# EAGLE schematic PulsePalSMT_Rev_0_5 (EAGLE 6.3)
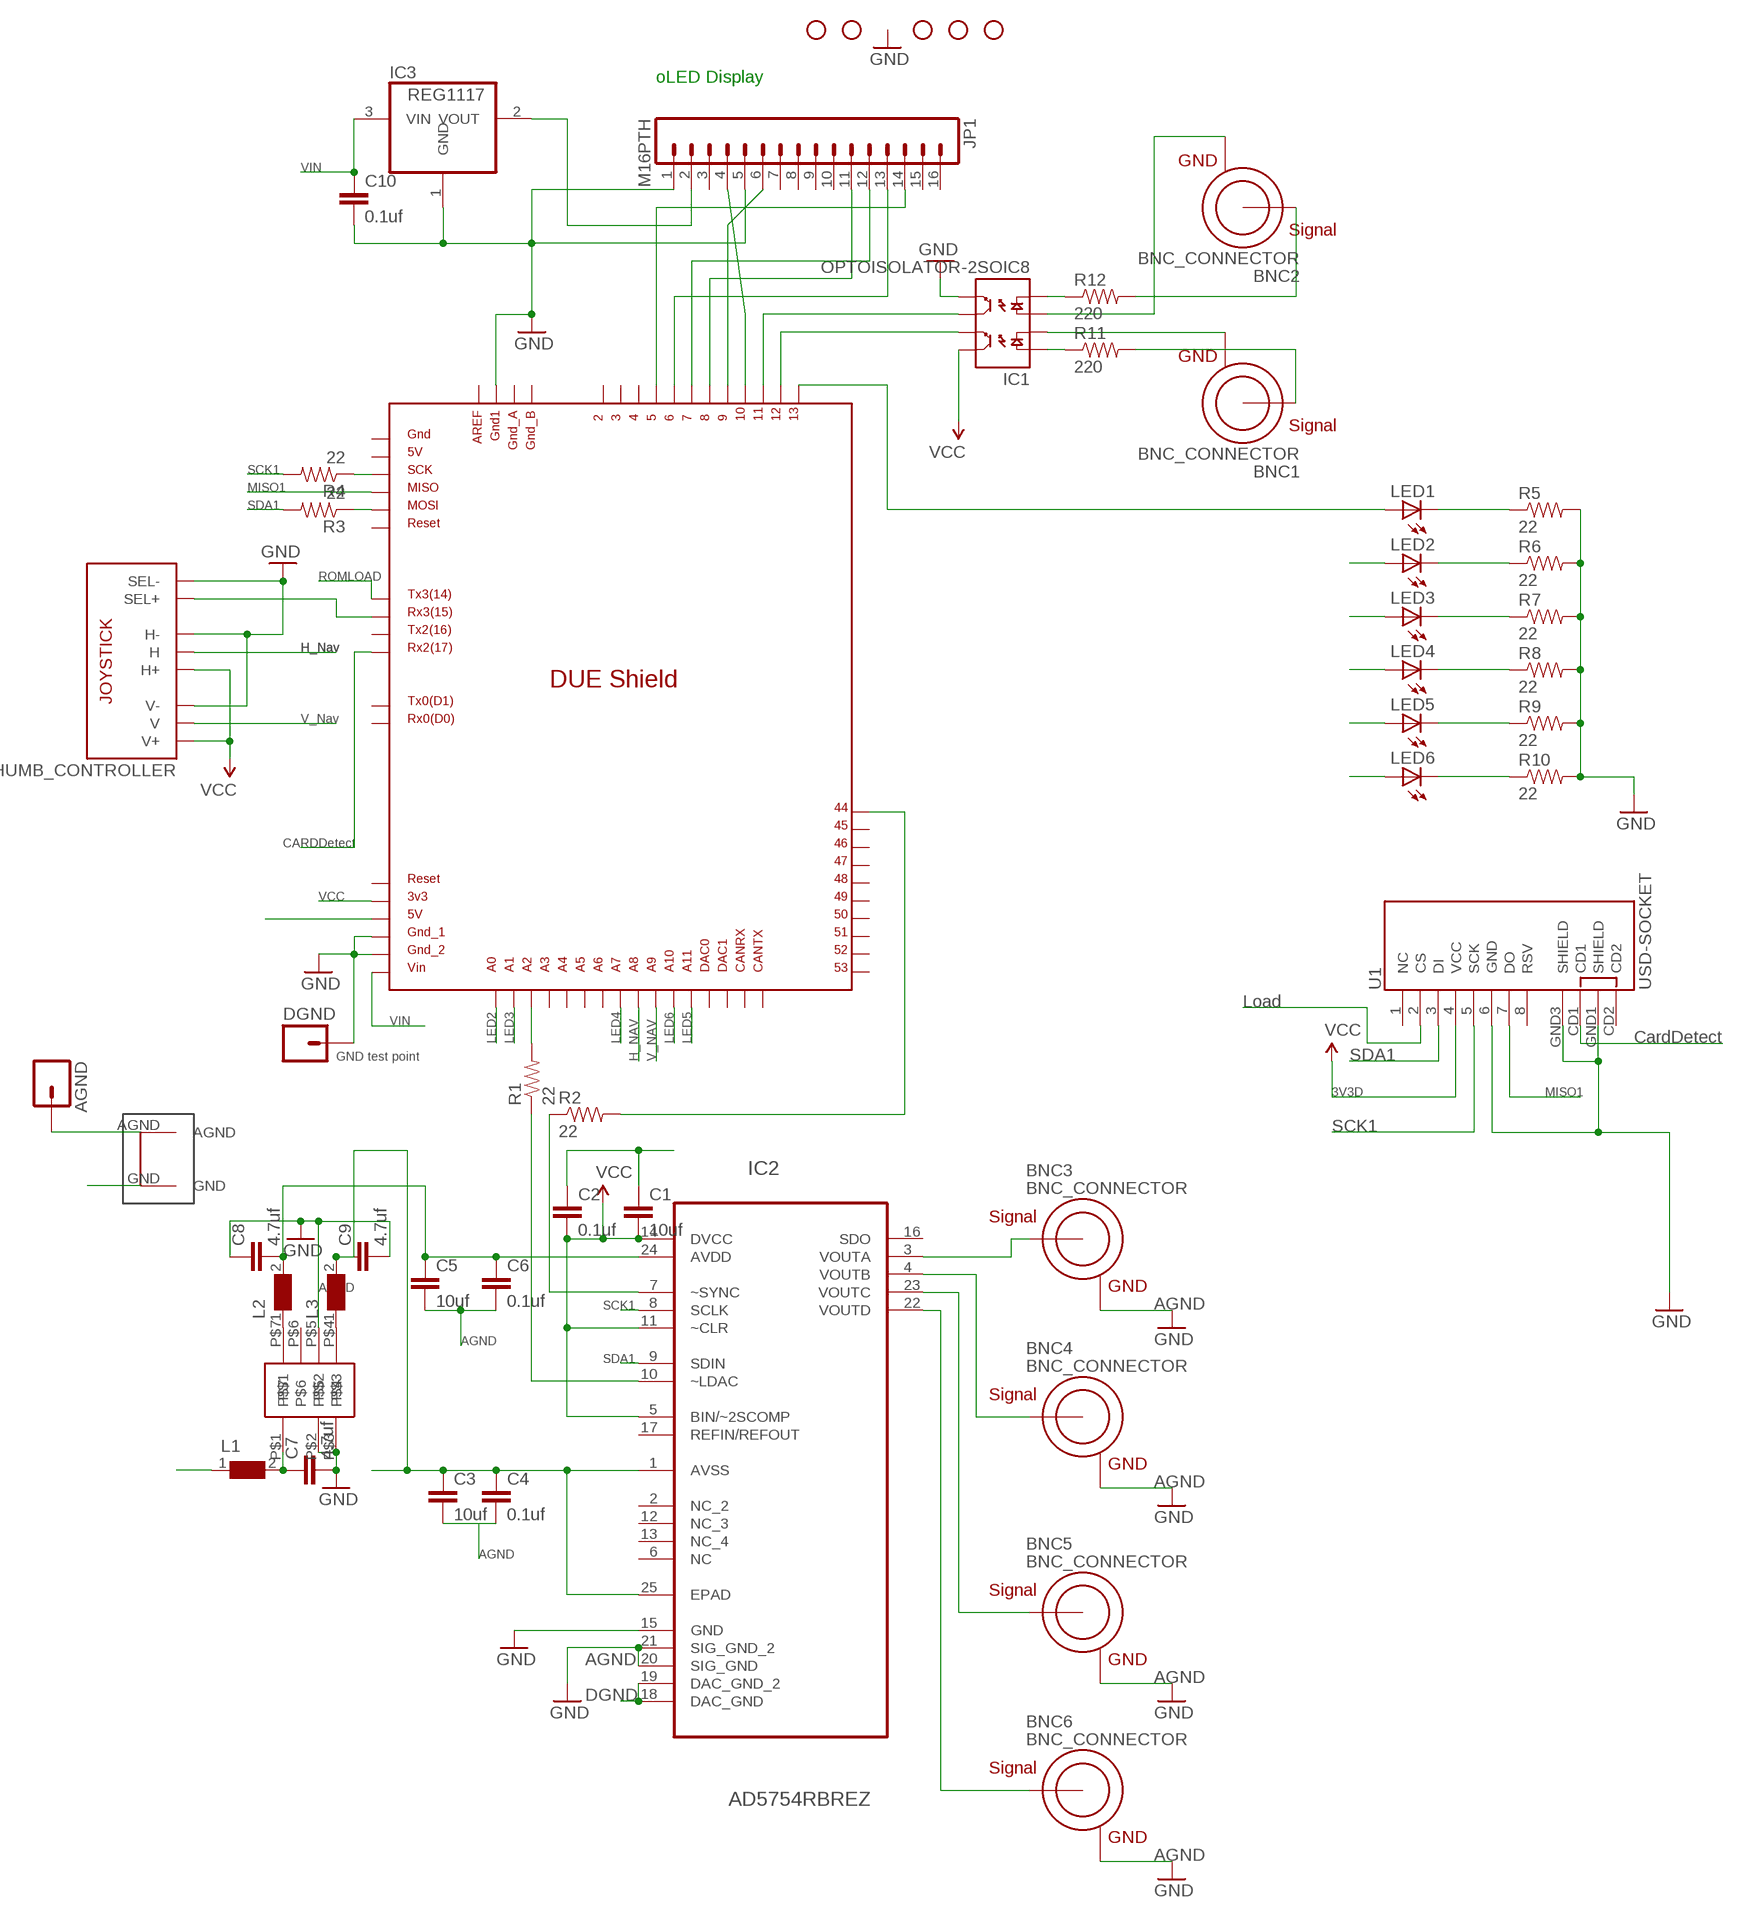
[diagram p0: schematic, sheet 1]

## Parts
AGND  M01PTH  [1X01]
ARDUINO  DUE(NORMAL)  [DUE(NORMAL)]
BNC1  BNC_CONNECTOR  [BNC_CONNECTOR]
BNC2  BNC_CONNECTOR  [BNC_CONNECTOR]
BNC3  BNC_CONNECTOR  [BNC_CONNECTOR]
BNC4  BNC_CONNECTOR  [BNC_CONNECTOR]
BNC5  BNC_CONNECTOR  [BNC_CONNECTOR]
BNC6  BNC_CONNECTOR  [BNC_CONNECTOR]
C1  10uf  CAP1206  [1206]
C2  0.1uf  CAP0603-CAP  [0603-CAP]
C3  10uf  CAP1206  [1206]
C4  0.1uf  CAP0603-CAP  [0603-CAP]
C5  10uf  CAP1206  [1206]
C6  0.1uf  CAP0603-CAP  [0603-CAP]
C7  4.7uf  CAP1206  [1206]
C8  4.7uf  CAP1206  [1206]
C9  4.7uf  CAP1206  [1206]
C10  0.1uf  CAP0603-CAP  [0603-CAP]
DGND  M01PTH  [1X01]
IC1  OPTOISOLATOR-2SOIC8  [SO08-2]
IC2  AD5754RBREZ  [SOP65P640X120-25N]
IC3  REG1117  [SOT223]
JP1  M16PTH  [1X16]
JP2  STAND-OFF  [STAND-OFF]
JP5  STAND-OFF  [STAND-OFF]
JP6  STAND-OFF  [STAND-OFF]
JP8  STAND-OFF  [STAND-OFF]
JP9  STAND-OFF  [STAND-OFF]
L1  WE-CBF-742792118_1206  [1206]
L2  WE-CBF-742792118_1206  [1206]
L3  WE-CBF-742792118_1206  [1206]
LED1  LEDCHIPLED_1206  [CHIPLED_1206]
LED2  LEDCHIPLED_1206  [CHIPLED_1206]
LED3  LEDCHIPLED_1206  [CHIPLED_1206]
LED4  LEDCHIPLED_1206  [CHIPLED_1206]
LED5  LEDCHIPLED_1206  [CHIPLED_1206]
LED6  LEDCHIPLED_1206  [CHIPLED_1206]
R1  22  RESISTOR1206  [1206]
R2  22  RESISTOR1206  [1206]
R3  22  RESISTOR1206  [1206]
R4  22  RESISTOR1206  [1206]
R5  22  RESISTOR1206  [1206]
R6  22  RESISTOR1206  [1206]
R7  22  RESISTOR1206  [1206]
R8  22  RESISTOR1206  [1206]
R9  22  RESISTOR1206  [1206]
R10  22  RESISTOR1206  [1206]
R11  220  RESISTOR1206  [1206]
R12  220  RESISTOR1206  [1206]
THUMB_CONTROLLER  JOYSTICKPTH  [JOYSTICK]
U1  USD-SOCKET  [MICROSD_1:1]
U2  TDK_LAMBDA_5_TO_BI_12_125MA  [TDK_LAMBDA_5_TO_BI_12_125MA]
U$6  GNDPLANESHRT  [GNDPLANESHRT]

## Nets
5V: ARDUINO.5V C1.2 C2.2 IC2.5(BIN/~2SCOMP) IC2.11(~CLR) IC2.14(DVCC) L1.1 ; supply symbol labelled VCC
AGND: AGND.1 BNC3.GND BNC4.GND BNC5.GND BNC6.GND C3.2 C4.2 C5.2 C6.2 IC2.15(GND) IC2.18(DAC_GND) IC2.19(DAC_GND_2) IC2.20(SIG_GND) IC2.21(SIG_GND_2) U$6.AGND ; supply symbol labelled GND
CARDDETECT: ARDUINO.RX2 U1.CD1
GND: ARDUINO.GND1 ARDUINO.GND_1 ARDUINO.GND_2 C1.1 C2.1 C7.2 C8.1 C9.2 C10.2 DGND.1 IC1.5(EM2) IC3.1(GND) JP1.1 JP1.5 R5.2 R6.2 R7.2 R8.2 R9.2 R10.2 THUMB_CONTROLLER.B2A(SEL-) THUMB_CONTROLLER.H3(H-) THUMB_CONTROLLER.V3(V-) U1.6(GND) U1.GND1(SHIELD) U1.GND3(SHIELD) U2.P$2 U2.P$3 U2.P$5 U$6.GND
H_NAV: ARDUINO.A8 THUMB_CONTROLLER.H2(H)
LED2: ARDUINO.A0 LED2.A
LED3: ARDUINO.A1 LED3.A
LED4: ARDUINO.A7 LED4.A
LED5: ARDUINO.A11 LED5.A
LED6: ARDUINO.A10 LED6.A
MISO1: ARDUINO.MISO_ICSP U1.7(DO)
N$1: L2.1 U2.P$7
N$2: L3.1 U2.P$4
N$3: BNC3.SIGNAL IC2.3(VOUTA)
N$4: BNC4.SIGNAL IC2.4(VOUTB)
N$5: BNC5.SIGNAL IC2.23(VOUTC)
N$6: BNC6.SIGNAL IC2.22(VOUTD)
N$7: BNC1.GND IC1.2(C1)
N$8: BNC1.SIGNAL R11.2
N$9: BNC2.GND IC1.3(A2)
N$10: BNC2.SIGNAL R12.2
N$11: ARDUINO.SCK_ICSP R4.1
N$12: ARDUINO.MOSI_ICSP R3.1
N$13: ARDUINO.44 R2.2
N$14: ARDUINO.A2 R1.2
N$15: IC2.7(~SYNC) R2.1
N$16: IC2.10(~LDAC) R1.1
N$17: ARDUINO.RX3 THUMB_CONTROLLER.B1A(SEL+)
N$18: ARDUINO.11 IC1.6(CL2)
N$20: IC3.2(VOUT) JP1.2
N$21: LED1.C R5.1
N$22: LED2.C R6.1
N$23: LED3.C R7.1
N$24: LED4.C R8.1
N$25: LED5.C R9.1
N$26: LED6.C R10.1
N$27: IC1.1(A1) R11.1
N$28: IC1.4(C2) R12.1
N$29: ARDUINO.12 IC1.7(EM1)
N$30: ARDUINO.5 JP1.14
N$31: ARDUINO.13 LED1.A
N$32: ARDUINO.10 JP1.4
N$33: ARDUINO.9 JP1.6
N$34: ARDUINO.8 JP1.11
N$35: ARDUINO.7 JP1.12
N$36: ARDUINO.6 JP1.13
N$39: C5.1 C6.1 C8.2 IC2.24(AVDD) L2.2
N$40: C3.1 C4.1 C9.1 IC2.1(AVSS) IC2.25(EPAD) L3.2
N$41: C7.1 L1.2 U2.P$1
ROMLOAD: ARDUINO.TX3 U1.2(CS)
SCK1: IC2.8(SCLK) R4.2 U1.5(SCK)
SDA1: IC2.9(SDIN) R3.2 U1.3(DI)
V_NAV: ARDUINO.A9 THUMB_CONTROLLER.V2(V)
VCC: ARDUINO.3V3 IC1.8(CL1) THUMB_CONTROLLER.H1(H+) THUMB_CONTROLLER.V1(V+) U1.4(VCC)
VIN: ARDUINO.VIN C10.1 IC3.3(VIN)
Unconnected: ARDUINO.2 ARDUINO.3 ARDUINO.4 ARDUINO.5V_ICSP ARDUINO.45 ARDUINO.46 ARDUINO.47 ARDUINO.48 ARDUINO.49 ARDUINO.50 ARDUINO.51 ARDUINO.52 ARDUINO.53 ARDUINO.A3 ARDUINO.A4 ARDUINO.A5 ARDUINO.A6 ARDUINO.AREF ARDUINO.CANRX ARDUINO.CANTX ARDUINO.DAC0 ARDUINO.DAC1 ARDUINO.GND_A ARDUINO.GND_B ARDUINO.GND_ICSP ARDUINO.RESET ARDUINO.RESET_ICSP ARDUINO.RX0 ARDUINO.TX0 ARDUINO.TX2 IC2.2(NC_2) IC2.6(NC) IC2.12(NC_3) IC2.13(NC_4) IC2.16(SDO) IC2.17(REFIN/REFOUT) JP1.3 JP1.7 JP1.8 JP1.9 JP1.10 JP1.15 JP1.16 U1.1(NC) U1.8(RSV) U1.CD2 U2.P$6

## Notes on the sheet
- oLED Display
- VIN
- SCK1
- MISO1
- SDA1
- ROMLOAD
- H_Nav | H_Nav
- V_Nav
- CARDDetect
- VCC
- Load
- VIN
- LED2 | LED3 | LED4 | LED6 | LED5 | CardDetect
- GND test point | H_NAV | V_NAV | SDA1
- 3V3D | MISO1
- SCK1
- AGND
- SCK1 | AGND
- AGND
- SDA1
- AGND
- AGND
- AGND
- AGND
- DGND
- AGND

## Library data of the parts
AGND DGND = SparkFun-Connectors:M01: Header 1 Standard 1-pin 0.1" header. Use with straight break away headers (SKU : PRT-00116), right angle break away headers (PRT-00553), swiss pins (PRT-00743), machine pins (PRT-00117), and female headers (PRT-00115).
ARDUINO = DUElib130425_JS2:DUE(NORMAL)
BNC1-BNC6 = JoshParts:BNC_CONNECTOR
C1-C10 = SparkFun-Capacitors:CAP: Capacitor Standard 0603 ceramic capacitor, and 0.1" leaded capacitor.
IC1 = SparkFun-DiscreteSemi:OPTOISOLATOR-2: Description: Dual gate opto isolator. Vishay part : ILD213T; PROD_ID: IC-09076
IC2 = Analog Devices_By_element14_Batch_1:AD5754RBREZ: DAC; MPN: AD5754RBREZ; OC_FARNELL: 1786050; OC_NEWARK: 51P3755; PACKAGE: TSSOP-24; SUPPLIER: Analog Devices
IC3 = burr-brown:REG1117: 800mA and 1A Low Dropout (LDO) Positive Regulator 1.8V, 2.5V, 2.85V, 3.3V, 5V, and Adj; MPN: REG1117; OC_FARNELL: 1097566; OC_NEWARK: 14P6981
JP1 = SparkFun:M16
JP2 JP5 JP6 JP8 JP9 = SparkFun:STAND-OFF: Stand Off This is the mechanical footprint for a #4 phillips button head screw. Use the keepout ring to avoid running the screw head into surrounding components. SKU : PRT-00447
L1-L3 = WE-CBF:WE-CBF: SMD EMI Suppression Ferrite Beads WE-CBF - Excellent anti-EMI properties - Low DC-restistance - Impedances till 3000 ohms - Rated current up to 6 A -- Reliable Ni-Sn electrodes -- Perfect as data lined filter and for uncoupling of distribution voltage; MPN: 742792118; OC_FARNELL: 1800374; OC_NEWARK: 78R5648; PACKAGE: IND-1206; SUPPLIER: Wuerth Elektronik
LED1-LED6 = led:LED: LED OSRAM: - CHIPLED LG R971, LG N971, LY N971, LG Q971, LY Q971, LO R971, LY R971 LH N974, LH R974 LS Q976, LO Q976, LY Q976 LO Q996 - Hyper CHIPLED LW Q18S LB Q993, LB Q99A, LB R99A - SideLED LS A670, LO A670, LY A670, LG A670, LP A670 LB A673, LV A673, LT A673, LW A673 LH A674 LY A675 LS A676, LA A676, LO A676, LY A676, LW A676 LS A679, LY A679, LG A679 - Hyper Micro SIDELED® LS Y876, LA Y876, LO Y876, LY Y876 LT Y87S - SmartLED LW L88C, LW L88S LB L89C, LB L89S, LG L890 LS L89K, LO L89K, LY L89K LS L896, LA L896, LO L896, LY L896 - TOPLED LS T670, LO T670, LY T670, LG T670, LP T670 LSG T670, LSP T670, LSY T670, LOP T670, LYG T670 LG T671, LOG T671, LSG T671 LB T673, LV T673, LT T673, LW T673 LH T674 LS T676, LA T676, LO T676, LY T676, LB T676, LH T676, LSB T676, LW T676 LB T67C, LV T67C, LT T67C, LS T67K, LO T67K, LY T67K, LW E67C LS E67B, LA E67B, LO E67B, LY E67B, LB E67C, LV E67C, LT E67C LW T67C LS T679, LY T679, LG T679 LS T770, LO T770, LY T770, LG T770, LP T770 LB T773, LV T773, LT T773, LW T773 LH T774 LS E675, LA E675, LY E675, LS T675 LS T776, LA T776, LO T776, LY T776, LB T776 LHGB T686 LT T68C, LB T68C - Hyper Mini TOPLED® LB M676 - Mini TOPLED Santana® LG M470 LS M47K, LO M47K, LY M47K Source: http://www.osram.convergy.de LUXEON: - LUMILED® LXK2-PW12-R00, LXK2-PW12-S00, LXK2-PW14-U00, LXK2-PW14-V00 LXK2-PM12-R00, LXK2-PM12-S00, LXK2-PM14-U00 LXK2-PE12-Q00, LXK2-PE12-R00, LXK2-PE12-S00, LXK2-PE14-T00, LXK2-PE14-U00 LXK2-PB12-K00, LXK2-PB12-L00, LXK2-PB12-M00, LXK2-PB14-N00, LXK2-PB14-P00, LXK2-PB14-Q00 LXK2-PR12-L00, LXK2-PR12-M00, LXK2-PR14-Q00, LXK2-PR14-R00 LXK2-PD12-Q00, LXK2-PD12-R00, LXK2-PD12-S00 LXK2-PH12-R00, LXK2-PH12-S00 LXK2-PL12-P00, LXK2-PL12-Q00, LXK2-PL12-R00 Source: www.luxeon.com KINGBRIGHT: KA-3528ASYC Source: www.kingbright.com
R1-R4 R11 R12 = SparkFun-Resistors:RESISTOR: Resistor Basic schematic elements and footprints for 0603, 1206, and PTH resistors.
R5-R10 = SparkFun:RESISTOR: Resistor Basic schematic elements and footprints for 0603, 1206, and PTH resistors.
THUMB_CONTROLLER = SparkFun:JOYSTICK: Thumb Joystick Joystick commonly found in PS2 controllers. Two pots and a select switch. Footprint proven. Spark Fun Electronics SKU : COM-09032
U1 = SparkFun-Connectors:USD-SOCKET: microSD Socket Push-push type uSD socket. Schematic element and footprint production proven. Spark Fun Electronics SKU : PRT-00127. tDoc lines correctly indicate media card edge positions when inserting (unlocked, locked, depressed). NOTE: CD1 and CD2 are connected internally; PROD_ID: CONN-07820
U2 = JoshParts:TDK_LAMBDA_5_TO_BI_12_125MA
U$6 = Joshparts2:GNDPLANESHRT

## Net classes
0 default: width 0.203 mm
1 vcc: width 0.254 mm